# Altium schematic sheet Power.SchDoc
size A3
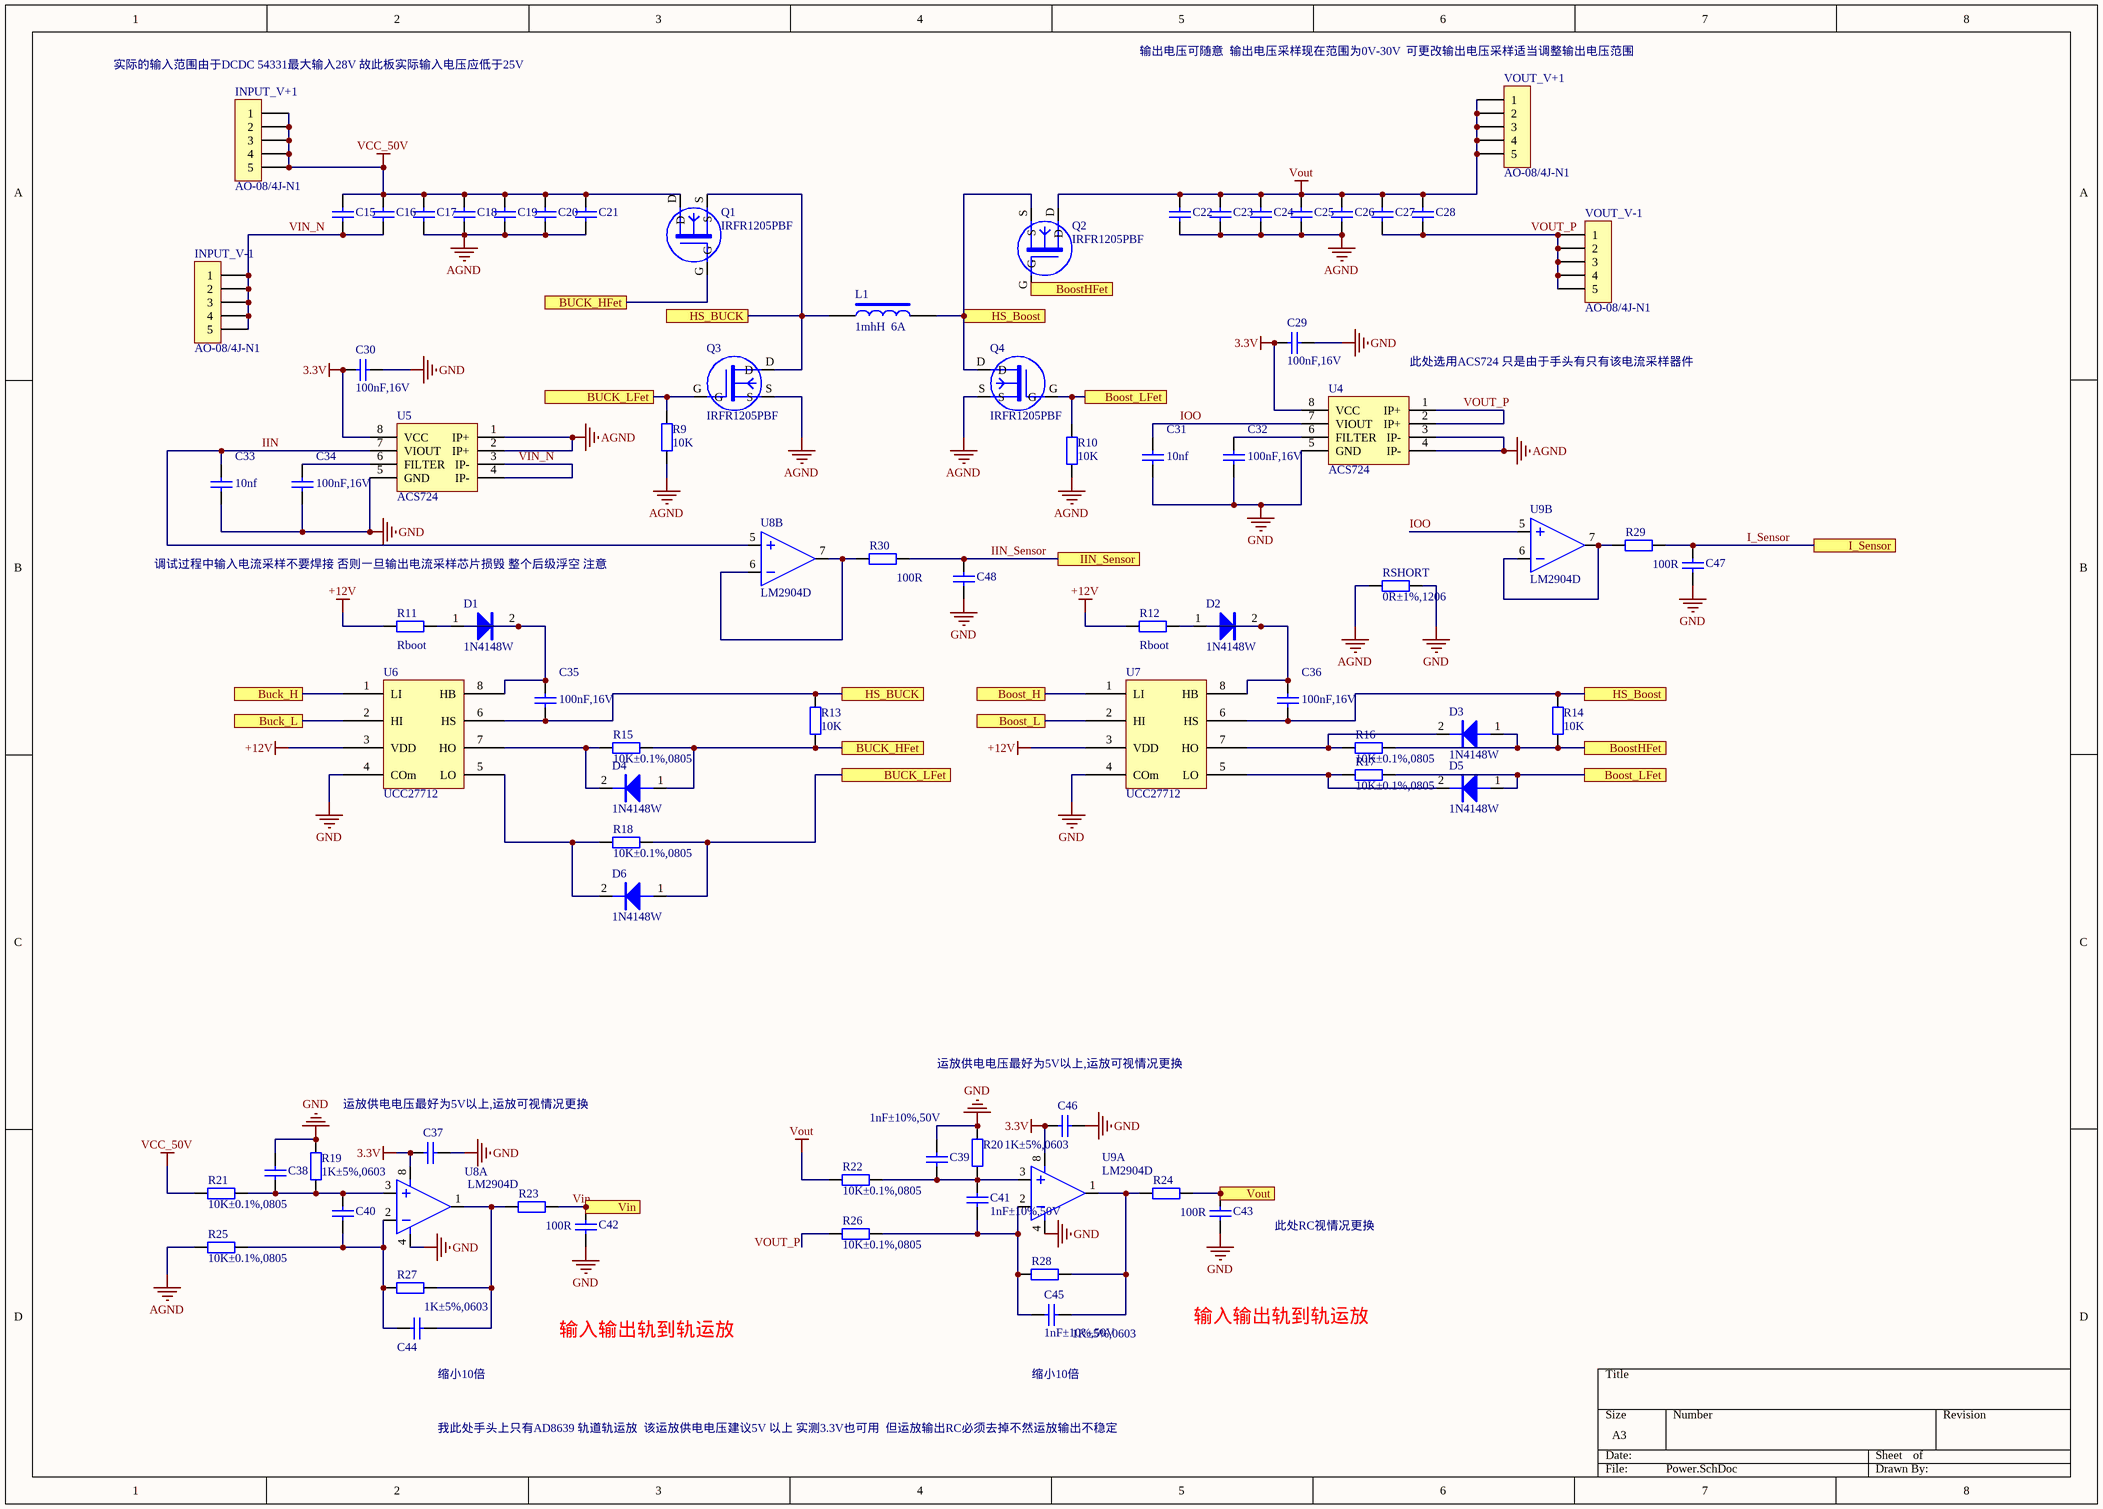
[diagram p0: Power.SchDoc]

## Parts
C15  4.7uF±10%,50V  [1812]  (value not drawn)
C16  4.7uF±10%,50V  [1812]  (value not drawn)
C17  4.7uF±10%,50V  [1812]  (value not drawn)
C18  4.7uF±10%,50V  [1812]  (value not drawn)
C19  4.7uF±10%,50V  [1812]  (value not drawn)
C20  4.7uF±10%,50V  [1812]  (value not drawn)
C21  4.7uF±10%,50V  [1812]  (value not drawn)
C22  4.7uF±10%,50V  [1812]  (value not drawn)
C23  4.7uF±10%,50V  [1812]  (value not drawn)
C24  4.7uF±10%,50V  [1812]  (value not drawn)
C25  4.7uF±10%,50V  [1812]  (value not drawn)
C26  4.7uF±10%,50V  [1812]  (value not drawn)
C27  4.7uF±10%,50V  [1812]  (value not drawn)
C28  4.7uF±10%,50V  [1812]  (value not drawn)
C29  100nF,16V  [0603]
C30  100nF,16V  [0603]
C31  10nf  [0603]
C32  100nF,16V  [0603]
C33  10nf  [0603]
C34  100nF,16V  [0603]
C35  100nF,16V  [0603]
C36  100nF,16V  [0603]
C37  (no value)  [0603]
C38  (no value)  [0603]
C39  1nF±10%,50V  [0603]
C40  (no value)  [0603]
C41  1nF±10%,50V  [0603]
C42  (no value)  [0603]
C43  (no value)  [0603]
C44  (no value)  [0603]
C45  1nF±10%,50V  [0603]
C46  (no value)  [0603]
C47  (no value)  [0603]
C48  (no value)  [0603]
D1  1N4148W  [SOD-123]
D2  1N4148W  [SOD-123]
D3  1N4148W  [SOD-123]
D4  1N4148W  [SOD-123]
D5  1N4148W  [SOD-123]
D6  1N4148W  [SOD-123]
INPUT_V+1  AO-08/4J-N1  [A076]
INPUT_V-1  AO-08/4J-N1  [A076]
L1  1mhH  6A  [1770-inductor]
Q1  IRFR1205PBF  [TO-252AA]
Q2  IRFR1205PBF  [TO-252AA]
Q3  IRFR1205PBF  [TO-252AA]
Q4  IRFR1205PBF  [TO-252AA]
R9  10K  [0805r]
R10  10K  [0805r]
R11  Rboot  [0805r]
R12  Rboot  [0805r]
R13  10K  [0805R]
R14  10K  [0805r]
R15  10K±0.1%,0805  [0805r]
R16  10K±0.1%,0805  [0805r]
R17  10K±0.1%,0805  [0805r]
R18  10K±0.1%,0805  [0805r]
R19  1K±5%,0603  [0603]
R20  1K±5%,0603  [0603]
R21  10K±0.1%,0805  [0805r]
R22  10K±0.1%,0805  [0805r]
R23  100R  [0603]
R24  100R  [0603]
R25  10K±0.1%,0805  [0805r]
R26  10K±0.1%,0805  [0805r]
R27  1K±5%,0603  [0603]
R28  1K±5%,0603  [0603]
R29  100R  [0603]
R30  100R  [0603]
RSHORT  0R±1%,1206  [1206]
U4  ACS724  [SOIC-8]
U5  ACS724  [SOIC-8]
U6  UCC27712  [SOIC-8]
U7  UCC27712  [SOIC-8]
U8  LM2904D  [SO-8]  (parts A,B of 2)
U9  LM2904D  [SO-8]  (parts A,B of 2)
VOUT_V+1  AO-08/4J-N1  [A076]
VOUT_V-1  AO-08/4J-N1  [A076]

## Ports
Boost_H, Boost_L, Boost_LFet, BoostHFet, Buck_H, BUCK_HFet, Buck_L, BUCK_LFet, HS_Boost, HS_BUCK, I_Sensor, IIN_Sensor, Vin, Vout

## Nets
3.3V: C29.2 C30.2 C37.2 C46.2 U4.8(VCC) U5.8(VCC) U8.8 U9.8
+12V: R11.1 R12.1 U6.3(VDD) U7.3(VDD)
AGND: C17.1 C18.1 C19.1 C20.1 C21.1 C22.1 C23.1 C24.1 C25.1 C26.1 Q3.S Q4.S R9.1 R10.1 R25.1 RSHORT.1 U4.3(IP-) U4.4(IP-) U5.1(IP+) U5.2(IP+)
GND: C29.1 C30.1 C31.1 C32.1 C33.1 C34.1 C37.1 C38.2 C39.2 C42.2 C43.2 C46.1 C47.2 C48.2 R19.2 R20.2 RSHORT.2 U4.5(GND) U5.5(GND) U6.4(COm) U7.4(COm) U8.4 U9.4
VCC_50V: C15.2 C16.2 C17.2 C18.2 C19.2 C20.2 C21.2 INPUT_V+1.1 INPUT_V+1.2 INPUT_V+1.3 INPUT_V+1.4 INPUT_V+1.5 Q1.D R21.1
Vout: C22.2 C23.2 C24.2 C25.2 C26.2 C27.2 C28.2 Q2.D R22.1 VOUT_V+1.1 VOUT_V+1.2 VOUT_V+1.3 VOUT_V+1.4 VOUT_V+1.5
Boost_H: U7.1(LI) ; port Boost_H
Boost_L: U7.2(HI) ; port Boost_L
Boost_LFet: D5.1(A) Q4.G R10.2 R17.2 ; port Boost_LFet
BoostHFet: D3.1(A) Q2.G R14.1 R16.2 ; port BoostHFet
Buck_H: U6.1(LI) ; port Buck_H
BUCK_HFet: D4.1(A) Q1.G R13.1 R15.2 ; port BUCK_HFet
Buck_L: U6.2(HI) ; port Buck_L
BUCK_LFet: D6.1(A) Q3.G R9.2 R18.2 ; port BUCK_LFet
HS_Boost: C36.1 L1.2 Q2.S Q4.D R14.2 U7.6(HS) ; port HS_Boost
HS_BUCK: C35.1 L1.1 Q1.S Q3.D R13.2 U6.6(HS) ; port HS_BUCK
I_Sensor: C47.1 R29.1 ; port I_Sensor
IIN: C33.2 U5.7(VIOUT) U8.5
IIN_Sensor: C48.1 R30.1 ; port IIN_Sensor
IOO: C31.2 U4.7(VIOUT) U9.5
Vin: C42.1 R23.1 ; port Vin
VIN_N: C15.1 C16.1 INPUT_V-1.1 INPUT_V-1.2 INPUT_V-1.3 INPUT_V-1.4 INPUT_V-1.5 U5.3(IP-) U5.4(IP-)
Vout: C43.1 R24.1 ; port Vout  [a separate net that carries the same name]
VOUT_P: C27.1 C28.1 R26.1 U4.1(IP+) U4.2(IP+) VOUT_V-1.1 VOUT_V-1.2 VOUT_V-1.3 VOUT_V-1.4 VOUT_V-1.5
NetC32_2: C32.2 U4.6(FILTER)
NetC34_2: C34.2 U5.6(FILTER)
NetC35_2: C35.2 D1.2(K) U6.8(HB)
NetC36_2: C36.2 D2.2(K) U7.8(HB)
NetC38_1: C38.1 C40.2 R19.1 R21.2 U8.3
NetC39_1: C39.1 C41.2 R20.1 R22.2 U9.3
NetC40_1: C40.1 C44.2 R25.2 R27.2 U8.2
NetC41_1: C41.1 C45.2 R26.2 R28.2 U9.2
NetC44_1: C44.1 R23.2 R27.1 U8.1
NetC45_1: C45.1 R24.2 R28.1 U9.1
NetD1_1: D1.1(A) R11.2
NetD2_1: D2.1(A) R12.2
NetD3_2: D3.2(K) R16.1 U7.7(HO)
NetD4_2: D4.2(K) R15.1 U6.7(HO)
NetD5_2: D5.2(K) R17.1 U7.5(LO)
NetD6_2: D6.2(K) R18.1 U6.5(LO)
NetR29_2: R29.2 U9.6 U9.7
NetR30_2: R30.2 U8.6 U8.7

## Notes on the sheet
- (near INPUT_V+1) 实际的输入范围由于DCDC 54331最大输入28V 故此板实际输入电压应低于25V
- 输出电压可随意  输出电压采样现在范围为0V-30V  可更改输出电压采样适当调整输出电压范围
- (near U4) 此处选用ACS724 只是由于手头有只有该电流采样器件
- 调试过程中输入电流采样不要焊接 否则一旦输出电流采样芯片损毁 整个后级浮空 注意
- 运放供电电压最好为5V以上,运放可视情况更换
- 此处RC视情况更换
- 输入输出轨到轨运放
- (near C44) 缩小10倍
- 缩小10倍
- 我此处手头上只有AD8639 轨道轨运放  该运放供电电压建议5V 以上 实测3.3V也可用  但运放输出RC必须去掉不然运放输出不稳定

## Library data of the parts
C15-C28 = 贴片电容,1812,4.7uF±10%,50V,X7R系列,TDK: 贴片电容; 物料代码: 1.02.15.0047506000
C29-C36 = 贴片电容,0603,100nF,16V: 贴片电容; 物料代码: 1.02.15.0010402010
C37 C38 C40 C42-C44 C46-C48 = 贴片电容,0603,100nF±10%,50V: 贴片电容; 物料代码: 1.02.15.0010406040
C39 C41 C45 = 贴片电容,0603,1nF±10%,50V: 贴片电容; 物料代码: 1.02.15.0010206030
D1-D6 = 整流二极管,1N4148W,100V,150mA,SOD-123: 整流二极管; 物料代码: 1.03.01.0414800020
INPUT_V+1 INPUT_V-1 VOUT_V+1 VOUT_V-1 = AO-08/4J-N1，7.8X7.8mm,DIP-4,M3螺纹孔,中心距5X7mm,表面镀锡: PCB接线端子; 物料代码: 1.06.99.2608410000
L1 = 1mH,800mA,0810: 贴片电感; 物料代码: 1.05.01.0100000000
Q1-Q4 = MOSFET功率管,IRFR1205PBF,55V,44A,27mR,NPN,TO-252AA: MOSFET功率管; 物料代码: 1.03.07.1120500000
R9-R14 = 4.7R±1%,MEF0207,0.5W,25PPM,品牌:EBG: 圆柱形精密贴片电阻; 物料代码: 1.01.11.0478250000
R15-R18 R21 R22 R25 R26 = 10K±0.1%,1/8w,0805: 贴片电阻; 物料代码: 1.01.11.1002020020
R19 R20 R23 R24 R27-R30 = 10K±5%,1/10W,0603: 贴片电阻; 物料代码: 1.01.11.0103010000
RSHORT = 0R±5%,1/4W,1206: 贴片电阻; 物料代码: 1.01.11.0000030000
U4 U5 = ACS724: 电流传感器; 物料代码: 1.04.01.0725200000
U8 U9 = 运算放大器,LM2904D,SO-8: 运算放大器; 物料代码: 1.04.07.0290400000